# EAGLE design line_follower (EAGLE 7.6.0)
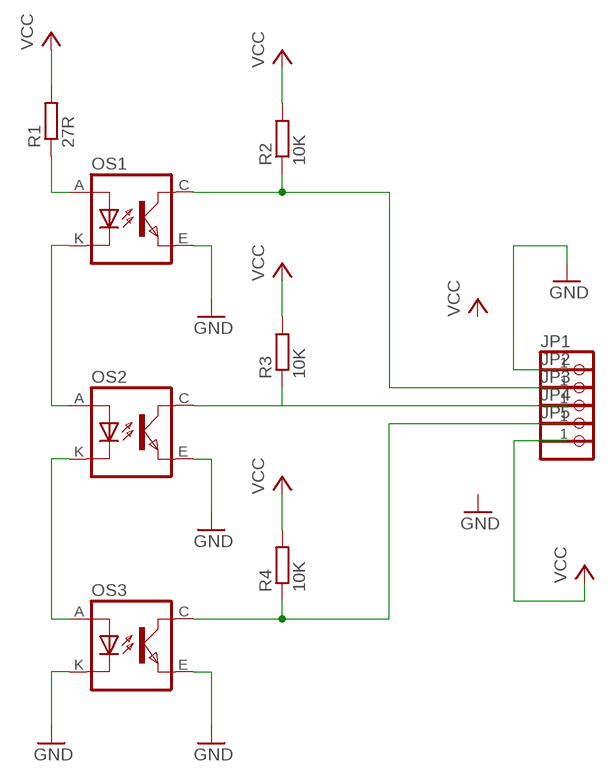
[diagram p0: schematic, sheet 1]

## Parts
JP1  PINHD-1X1  [1X01]
JP2  PINHD-1X1  [1X01]
JP3  PINHD-1X1  [1X01]
JP4  PINHD-1X1  [1X01]
JP5  PINHD-1X1  [1X01]
OS1  TCRT5000  [TCRT5000]
OS2  TCRT5000  [TCRT5000]
OS3  TCRT5000  [TCRT5000]
R1  27R  R-EU_0204/7  [0204/7]
R2  10K  R-EU_0204/7  [0204/7]
R3  10K  R-EU_0204/7  [0204/7]
R4  10K  R-EU_0204/7  [0204/7]

## Nets
GND: JP1.1 OS1.E(EMITTER) OS2.E(EMITTER) OS3.E(EMITTER) OS3.K(CATHODE)
N$1: OS1.K(CATHODE) OS2.A(ANODE)
N$2: OS2.K(CATHODE) OS3.A(ANODE)
N$3: OS1.A(ANODE) R1.1
N$4: JP2.1 OS1.C(COLLECTOR) R2.1
N$5: JP3.1 OS2.C(COLLECTOR) R3.1
N$6: JP4.1 OS3.C(COLLECTOR) R4.1
VCC: JP5.1 R1.2 R2.2 R3.2 R4.2

## Library data of the parts
JP1-JP5 = pinhead1:PINHD-1X1: PIN HEADER
OS1-OS3 = tcrt5000:TCRT5000
R1-R4 = resistor1:R-EU_: RESISTOR, European symbol

## Board
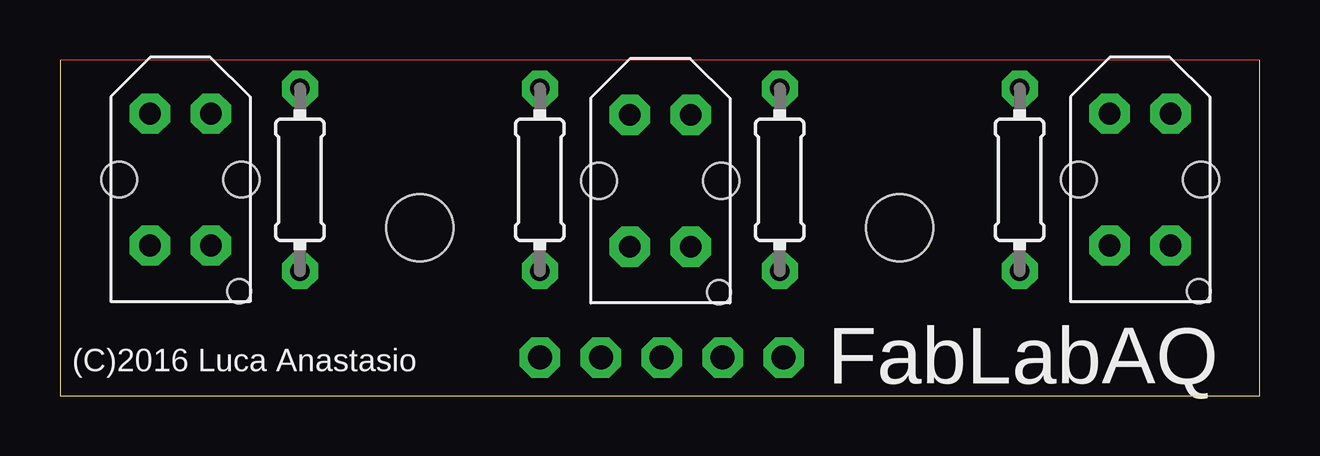
[diagram p1: board, top side]
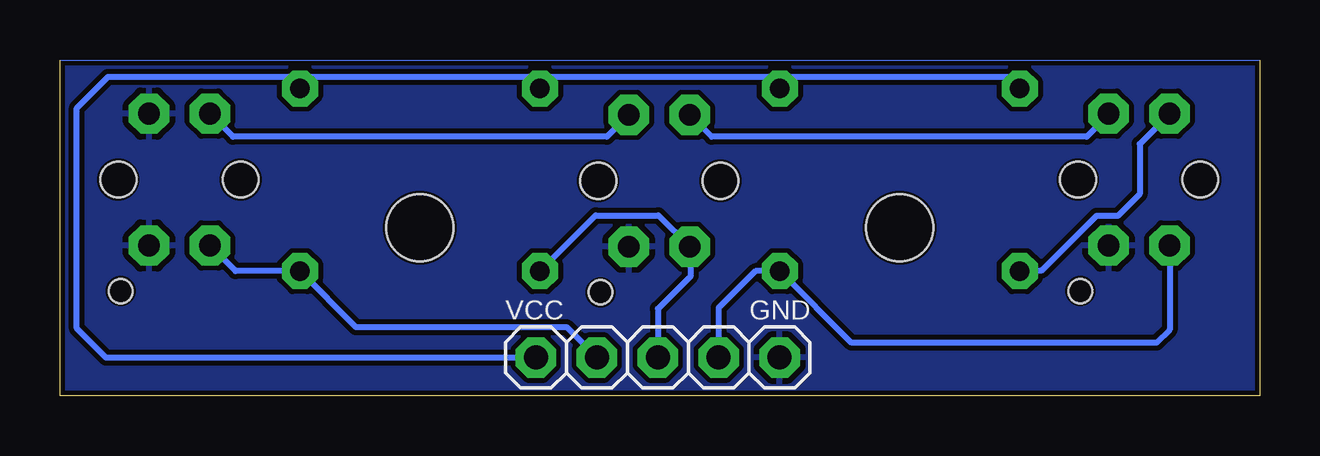
[diagram p2: board, bottom side, seen from below]

No outline drawn. Coordinates in mm, seen from the top.
Copper layers (1*16): Top 0.035mm / dielectric 1.5mm / Bottom 0.035mm
Design rules "default *": minimum track width 10mil, minimum drill 24mil, track to track 8mil, track to pad 8mil, pad to pad 8mil, via to via 8mil, smd to smd 8mil, copper to edge 2mil, drill to drill 2mil, minimum pad ring 10mil, minimum via ring 8mil, stop-mask expansion 4mil, vias tented up to drill 0mil, thermal gap 10mil
Holes 2.8 mm at 15,7 35,7
Milling: 3 lines

### Footprints (pad centres in the part's own frame; a part is rotated, then mirrored left to right if it is on the bottom)
1X01 = drill 1 pad 1.676 octagon: 1 0,0
TCRT5000 = drill 0.9 pad 1.676 octagon: A -2.75,-1.27; C 2.75,-1.27; E 2.75,1.27; K -2.75,1.27 | hole 1: 4.65,2.45 | hole 1.5: 0,2.55; 0,-2.55
0204/7 = drill 0.8 pad 1.5 octagon: 1 -3.81,0; 2 3.81,0

### Placement (x,y rotation side)
JP1  20,1.59 90 bottom
JP2  22.54,1.59 180 bottom
JP3  25.08,1.59 180 bottom
JP4  27.62,1.59 180 bottom
JP5  30.16,1.59 270 bottom
OS1  5.02,9.01 270 top
OS2  25.02,8.96 270 top
OS3  45.02,9.01 270 top
R1  10,9 90 top
R2  20,9 90 top
R3  30,9 90 top
R4  40,9 90 top

### Tracks (layer width: path | path; a pad name or v marks a point on that pad's centre or on a via)
GND
  pour Bottom (isolate 0.127, rank 6): 0,0 50,0 50,14 0,14
  pour Bottom (isolate 0.27, rank 6): 0,0 50,0 50,14 0,14
N$1
  Bottom 0.254: OS1.K 6.29,11.71 7.2,10.8 22.84,10.8 OS2.A
N$2
  Bottom 0.254: OS2.K 27.2,10.8 42.79,10.8 OS3.A
N$3
  Bottom 0.254: OS1.A 5,10.5 5,8.4 5.9,7.5 6.8,7.5 9.1,5.2 R1.1
N$4
  Bottom 0.254: OS1.C 3.75,2.75 4.3,2.2 17.01,2.2 R2.1 21.01,5.19 22.54,3.66 JP2.1
N$5
  Bottom 0.254: R3.1 27.67,7.52 25.06,7.52 OS2.C 23.7,6.16 23.7,5 25.08,3.62 JP3.1
N$6
  Bottom 0.254: OS3.C 42.68,5.19 R4.1 37.67,2.86 28.89,2.86 JP4.1
N$7
  Bottom 0: 0,0 50,0 50,14 0,14 0,0
N$8
  Top 0: 0,0 50,0 50,14 0,14 0,0
VCC
  Bottom 0.254: R1.2 10.5,13.3 19.51,13.3 R2.2 20.5,13.3 29.51,13.3 R3.2 30.5,13.3 39.51,13.3 R4.2 40.49,13.3 48,13.3 49.3,12 49.3,2.8 48.09,1.59 JP5.1

### Text on the board
tPlace: (C)2016 Luca Anastasio | FabLabAQ
bPlace: GND | VCC